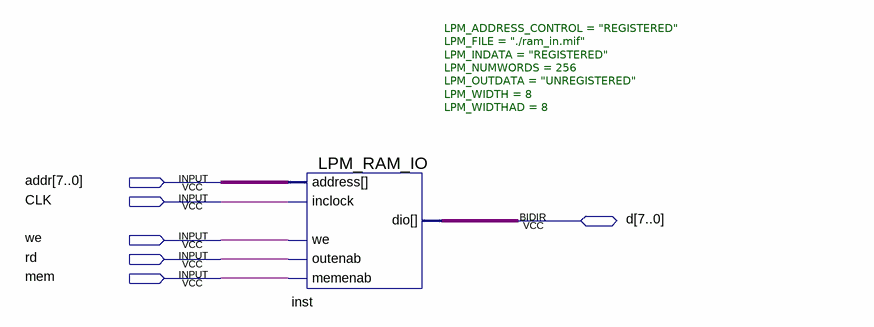
[diagram p0: schematic sheet]
// Quartus schematic ram.bdf as structural Verilog: 1 symbols, 6 pins
module ram (
  input  [7:0] addr,
  input  CLK,
  input  we,
  input  rd,
  input  mem,
  inout  [7:0] d
);

  LPM_RAM_IO #(.LPM_ADDRESS_CONTROL("REGISTERED"), .LPM_FILE("./ram_in.mif"), .LPM_INDATA("REGISTERED"), .LPM_NUMWORDS(256), .LPM_OUTDATA("UNREGISTERED"), .LPM_WIDTH(8), .LPM_WIDTHAD(8)) inst (
    .address(addr), .memenab(mem), .inclock(CLK), .we(we), .outenab(rd), .dio(d));
endmodule
